# EAGLE schematic untitled (EAGLE 7.6.0)
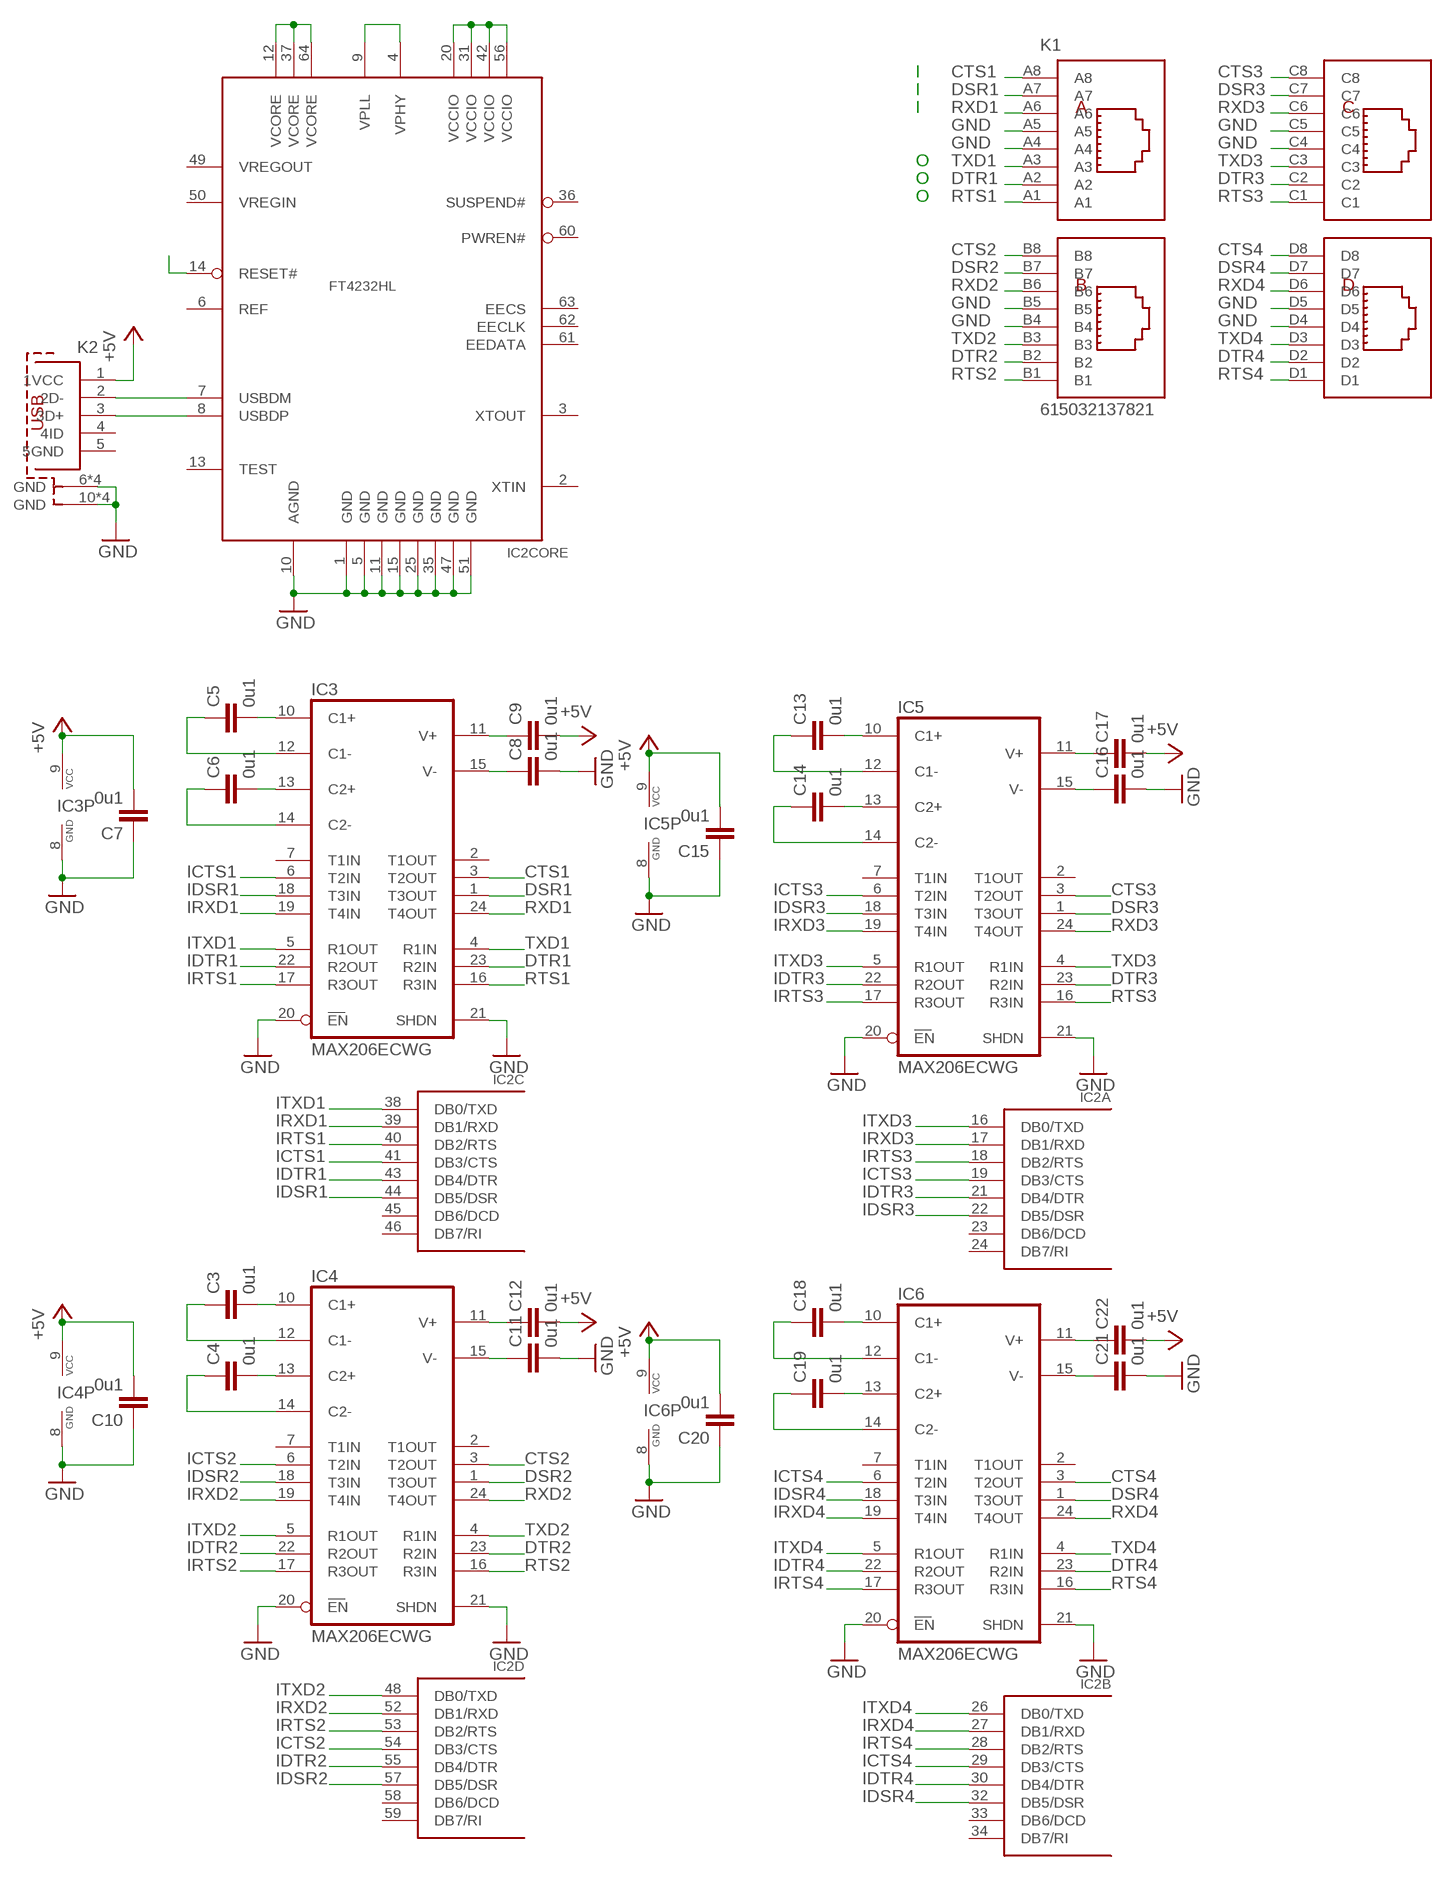
[diagram p0: schematic, sheet 1]

## Parts
C3  0u1  C-EUC0603  [C0603]
C4  0u1  C-EUC0603  [C0603]
C5  0u1  C-EUC0603  [C0603]
C6  0u1  C-EUC0603  [C0603]
C7  0u1  C-EUC0603  [C0603]
C8  0u1  C-EUC0603  [C0603]
C9  0u1  C-EUC0603  [C0603]
C10  0u1  C-EUC0603  [C0603]
C11  0u1  C-EUC0603  [C0603]
C12  0u1  C-EUC0603  [C0603]
C13  0u1  C-EUC0603  [C0603]
C14  0u1  C-EUC0603  [C0603]
C15  0u1  C-EUC0603  [C0603]
C16  0u1  C-EUC0603  [C0603]
C17  0u1  C-EUC0603  [C0603]
C18  0u1  C-EUC0603  [C0603]
C19  0u1  C-EUC0603  [C0603]
C20  0u1  C-EUC0603  [C0603]
C21  0u1  C-EUC0603  [C0603]
C22  0u1  C-EUC0603  [C0603]
IC2  FT4232HL  [LQFP64]
IC3  MAX206ECWG  [SO24L]
IC4  MAX206ECWG  [SO24L]
IC5  MAX206ECWG  [SO24L]
IC6  MAX206ECWG  [SO24L]
K1  615032137821  [615032137821]
K2  629105150921  [629105150921]

## Nets
+5V: C7.2 C9.2 C10.2 C12.2 C15.2 C17.2 C20.2 C22.2 IC3.9(VCC) IC4.9(VCC) IC5.9(VCC) IC6.9(VCC) K2.1(1VCC)
CTS1: IC3.3(T2OUT) K1.A8
CTS2: IC4.3(T2OUT) K1.B8
CTS3: IC5.3(T2OUT) K1.C8
CTS4: IC6.3(T2OUT) K1.D8
DSR1: IC3.1(T3OUT) K1.A7
DSR2: IC4.1(T3OUT) K1.B7
DSR3: IC5.1(T3OUT) K1.C7
DSR4: IC6.1(T3OUT) K1.D7
DTR1: IC3.23(R2IN) K1.A2
DTR2: IC4.23(R2IN) K1.B2
DTR3: IC5.23(R2IN) K1.C2
DTR4: IC6.23(R2IN) K1.D2
GND: C7.1 C8.2 C10.1 C11.2 C15.1 C16.2 C20.1 C21.2 IC2.1(CORE:GND) IC2.5(CORE:GND) IC2.10(CORE:AGND) IC2.11(CORE:GND) IC2.15(CORE:GND) IC2.25(CORE:GND) IC2.35(CORE:GND) IC2.47(CORE:GND) IC2.51(CORE:GND) IC3.8(GND) IC3.20(EN) IC3.21(SHDN) IC4.8(GND) IC4.20(EN) IC4.21(SHDN) IC5.8(GND) IC5.20(EN) IC5.21(SHDN) IC6.8(GND) IC6.20(EN) IC6.21(SHDN) K1.A4 K1.A5 K1.B4 K1.B5 K1.C4 K1.C5 K1.D4 K1.D5 K2.6(GND) K2.7(GND) K2.8(GND) K2.9(GND) K2.10(GND) K2.11(GND) K2.12(GND) K2.13(GND)
ICTS1: IC2.41(C:DB3/CTS) IC3.6(T2IN)
ICTS2: IC2.54(D:DB3/CTS) IC4.6(T2IN)
ICTS3: IC2.19(A:DB3/CTS) IC5.6(T2IN)
ICTS4: IC2.29(B:DB3/CTS) IC6.6(T2IN)
IDSR1: IC2.44(C:DB5/DSR) IC3.18(T3IN)
IDSR2: IC2.57(D:DB5/DSR) IC4.18(T3IN)
IDSR3: IC2.22(A:DB5/DSR) IC5.18(T3IN)
IDSR4: IC2.32(B:DB5/DSR) IC6.18(T3IN)
IDTR1: IC2.43(C:DB4/DTR) IC3.22(R2OUT)
IDTR2: IC2.55(D:DB4/DTR) IC4.22(R2OUT)
IDTR3: IC2.21(A:DB4/DTR) IC5.22(R2OUT)
IDTR4: IC2.30(B:DB4/DTR) IC6.22(R2OUT)
IRTS1: IC2.40(C:DB2/RTS) IC3.17(R3OUT)
IRTS2: IC2.53(D:DB2/RTS) IC4.17(R3OUT)
IRTS3: IC2.18(A:DB2/RTS) IC5.17(R3OUT)
IRTS4: IC2.28(B:DB2/RTS) IC6.17(R3OUT)
IRXD1: IC2.39(C:DB1/RXD) IC3.19(T4IN)
IRXD2: IC2.52(D:DB1/RXD) IC4.19(T4IN)
IRXD3: IC2.17(A:DB1/RXD) IC5.19(T4IN)
IRXD4: IC2.27(B:DB1/RXD) IC6.19(T4IN)
ITXD1: IC2.38(C:DB0/TXD) IC3.5(R1OUT)
ITXD2: IC2.48(D:DB0/TXD) IC4.5(R1OUT)
ITXD3: IC2.16(A:DB0/TXD) IC5.5(R1OUT)
ITXD4: IC2.26(B:DB0/TXD) IC6.5(R1OUT)
N$1: C3.2 IC4.10(C1+)
N$2: C3.1 IC4.12(C1-)
N$4: IC2.20(CORE:VCCIO) IC2.31(CORE:VCCIO) IC2.42(CORE:VCCIO) IC2.56(CORE:VCCIO)
N$5: IC2.4(CORE:VPHY) IC2.9(CORE:VPLL)
N$6: C4.2 IC4.13(C2+)
N$7: C5.2 IC3.10(C1+)
N$8: C5.1 IC3.12(C1-)
N$9: C6.2 IC3.13(C2+)
N$10: C6.1 IC3.14(C2-)
N$11: C4.1 IC4.14(C2-)
N$12: C12.1 IC4.11(V+)
N$13: C9.1 IC3.11(V+)
N$14: C8.1 IC3.15(V-)
N$15: C11.1 IC4.15(V-)
N$16: C13.2 IC5.10(C1+)
N$17: C13.1 IC5.12(C1-)
N$18: C14.2 IC5.13(C2+)
N$19: C14.1 IC5.14(C2-)
N$20: C17.1 IC5.11(V+)
N$21: C16.1 IC5.15(V-)
N$22: C18.2 IC6.10(C1+)
N$23: C18.1 IC6.12(C1-)
N$24: C19.2 IC6.13(C2+)
N$25: C19.1 IC6.14(C2-)
N$26: C22.1 IC6.11(V+)
N$27: C21.1 IC6.15(V-)
N$28: IC2.12(CORE:VCORE) IC2.37(CORE:VCORE) IC2.64(CORE:VCORE)
N$29: IC2.14(CORE:RESET#)
N$30: IC2.8(CORE:USBDP) K2.3(3D+)
N$31: IC2.7(CORE:USBDM) K2.2(2D-)
RTS1: IC3.16(R3IN) K1.A1
RTS2: IC4.16(R3IN) K1.B1
RTS3: IC5.16(R3IN) K1.C1
RTS4: IC6.16(R3IN) K1.D1
RXD1: IC3.24(T4OUT) K1.A6
RXD2: IC4.24(T4OUT) K1.B6
RXD3: IC5.24(T4OUT) K1.C6
RXD4: IC6.24(T4OUT) K1.D6
TXD1: IC3.4(R1IN) K1.A3
TXD2: IC4.4(R1IN) K1.B3
TXD3: IC5.4(R1IN) K1.C3
TXD4: IC6.4(R1IN) K1.D3
Unconnected: IC2.2(CORE:XTIN) IC2.3(CORE:XTOUT) IC2.6(CORE:REF) IC2.13(CORE:TEST) IC2.23(A:DB6/DCD) IC2.24(A:DB7/RI) IC2.33(B:DB6/DCD) IC2.34(B:DB7/RI) IC2.36(CORE:SUSPEND#) IC2.45(C:DB6/DCD) IC2.46(C:DB7/RI) IC2.49(CORE:VREGOUT) IC2.50(CORE:VREGIN) IC2.58(D:DB6/DCD) IC2.59(D:DB7/RI) IC2.60(CORE:PWREN#) IC2.61(CORE:EEDATA) IC2.62(CORE:EECLK) IC2.63(CORE:EECS) IC3.2(T1OUT) IC3.7(T1IN) IC4.2(T1OUT) IC4.7(T1IN) IC5.2(T1OUT) IC5.7(T1IN) IC6.2(T1OUT) IC6.7(T1IN) K2.4(4ID) K2.5(5GND)

## Notes on the sheet
- I
- I
- I
- O
- O
- O

## Library data of the parts
C3-C22 = rcl:C-EU: CAPACITOR, European symbol
IC2 = ftdichip-6:FT4232H: Quad USB UART 5th generation USB to 4-port serial controller
IC3-IC6 = maxim:MAX206ECWG: RS232 TRANSCEIVER; MF: MAXIM; MPN: MAX206ECWG+; OC_FARNELL: unknown; OC_NEWARK: 59J2964
K1 = Input-Output_Connectors_rev15d:615032137821: WR-MJ Horizontal Shielded Ganged 4 Ports 8P8C Modular Jack Tab Down, 32 Pins=>Code : Con_I-O_MJ-H_Shielded_Down_615032137821 <http://katalog.we-online.de/media/images/eican/Con_I-O_MJ-H_Shielded_Down_615032137821_pf2.jpg> Details see: http://katalog.we-online.de/en/em/615_032_137_821 Created 2014-07-10, Karrer Zheng 2014 (C) Würth Elektronik
K2 = Input-Output_Connectors_rev15d:629105150921: WR-COM_USB_Micro Type AB_Horizontal_SMT ; Micro Type AB Horizontal SMT - with Pegs - T&R Packaging Code : Con_I-O_COM_USB_2.0_AB_629105150921_629105150921 <http://katalog.we-online.de/media/images/eican/Con_I-O_COM_USB_2.0_AB_629105150921_pf2.jpg> Details see: http://katalog.we-online.de/em/datasheet/629105150921.pdf Created 12/08/2014, Dan Xu 2014 (C) Wurth Elektronik